# Altium schematic sheet DX-BT04-E02-V3.0_SCH_Part_AD.SchDoc
size A4
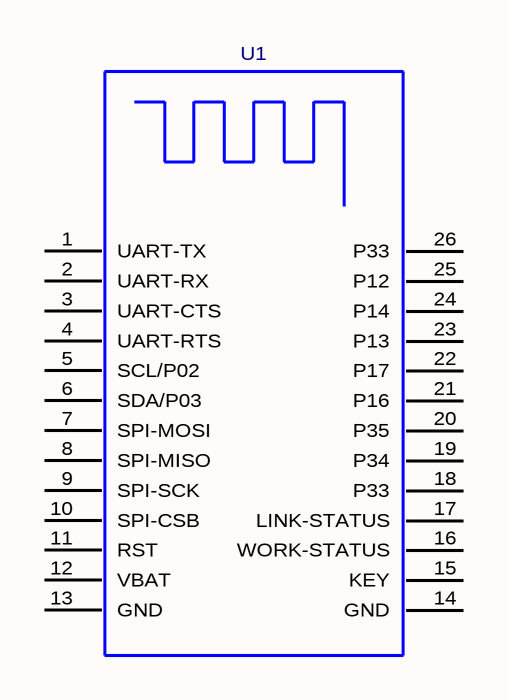
[diagram p0: DX-BT04-E02-V3.0_SCH_Part_AD.SchDoc]

## Parts
U1  DX-BT04-E02  [DX-BT04-E02]  (value not drawn)

## Nets

Not connected (* = marked no-connect by the designer): U1 1(UART-TX) 2(UART-RX) 3(UART-CTS) 4(UART-RTS) 5(SCL/P02) 6(SDA/P03) 7(SPI-MOSI) 8(SPI-MISO) 9(SPI-SCK) 10(SPI-CSB) 11(RST) 12(VBAT) 13(GND) 14(GND) 15(KEY) 16(WORK-STATUS) 17(LINK-STATUS) 18(P33) 19(P34) 20(P35) 21(P16) 22(P17) 23(P13) 24(P14) 25(P12) 26(P33)

## Library data of the parts
U1 = DX-BT04-E02: PCB DECAL: DX-BT24